# Altium schematic sheet SWD.SchDoc
size A4; SheetNumber: 6; SheetTotal: 9
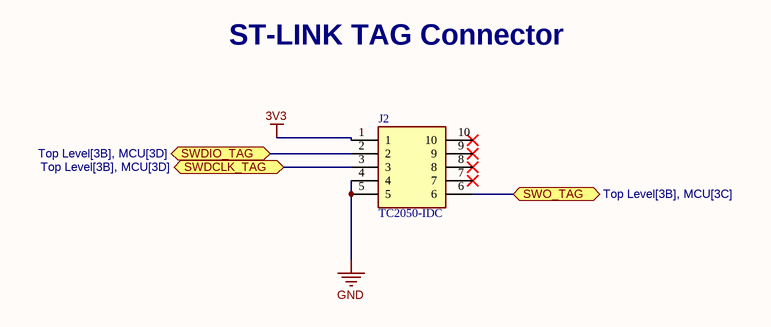
[diagram p0: SWD.SchDoc]

## Parts
J2  TC2050-IDC  [TC2050-IDC]

## Ports
SWDCLK_TAG (bidir, see Top Level[3B], MCU[3D]), SWDIO_TAG (bidir, see Top Level[3B], MCU[3D]), SWO_TAG (bidir, see Top Level[3B], MCU[3C])

## Nets
3V3: J2.1
GND: J2.4 J2.5
SWDCLK_TAG: J2.3 ; port SWDCLK_TAG
SWDIO_TAG: J2.2 ; port SWDIO_TAG
SWO_TAG: J2.6 ; port SWO_TAG

Not connected (* = marked no-connect by the designer): J2 7* 8* 9* 10*

## Notes on the sheet
- ST-LINK TAG Connector

## Library data of the parts
J2 = TC2050-IDC: Connector; Manufacturer_Name: Tag Connect; Datasheet Link: https://datasheet.datasheetarchive.com/originals/distributors/Datasheets_SAMA/51f607a36a24a0aceedaa5d6ebc30014.pdf; Manufacturer_Part_Number: TC2050-IDC